# EAGLE design Parking Sensor USB -v17b (EAGLE 5.11)
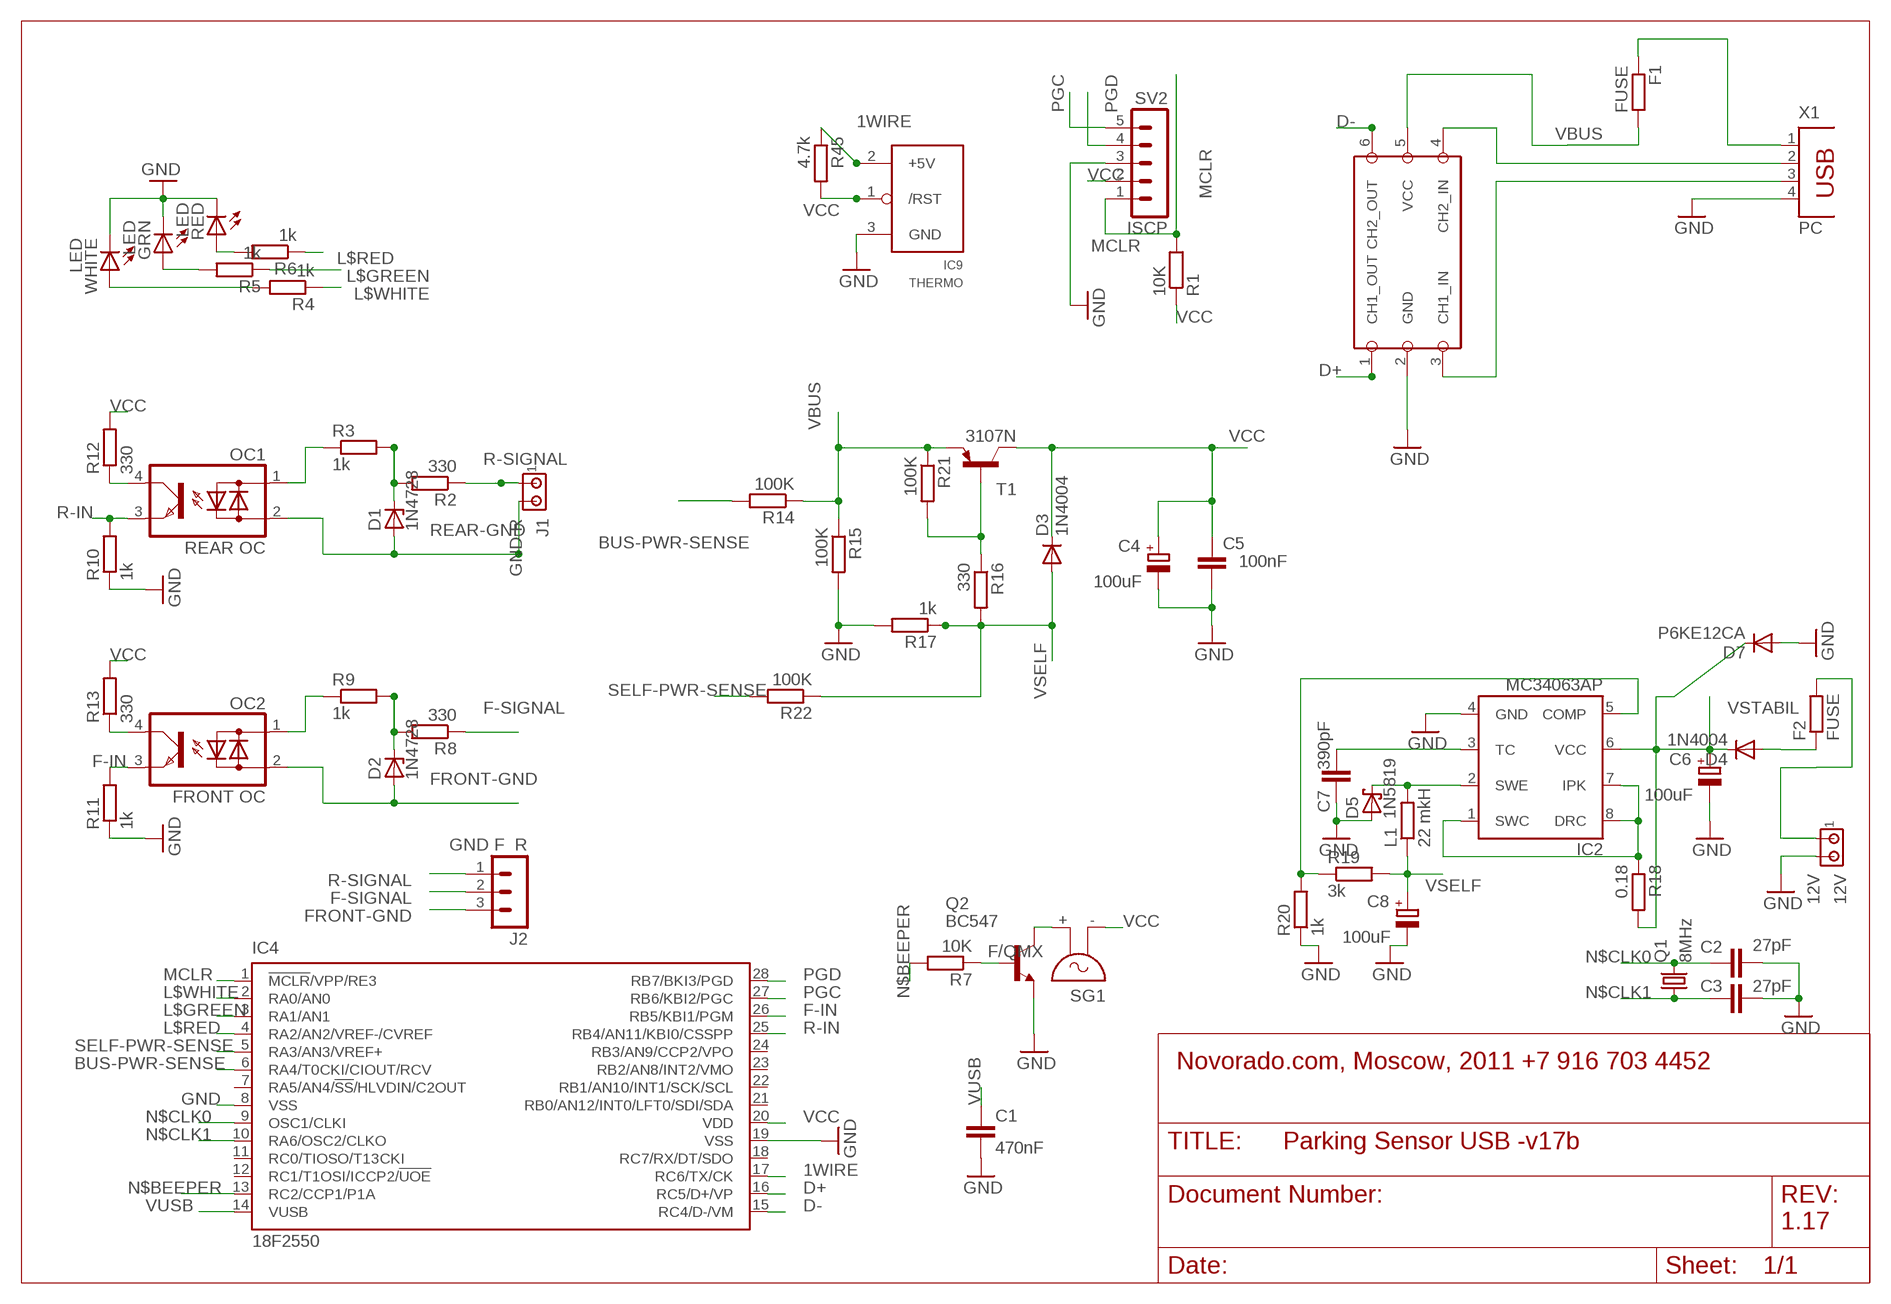
[diagram p0: schematic, sheet 1]

## Parts
12V  12V  MTA02-100  [10X02MTA]
C1  470nF  C-EU025-050X050  [C025-050X050]
C2  27pF  C-EU050-025X075  [C050-025X075]
C3  27pF  C-EU050-025X075  [C050-025X075]
C4  100uF  CPOL-EUE2.5-6  [E2,5-6]
C5  100nF  C-EU025-025X050  [C025-025X050]
C6  100uF  CPOL-EUE2.5-6  [E2,5-6]
C7  390pF  C-EU025-030X050  [C025-030X050]
C8  100uF  CPOL-EUE2.5-6  [E2,5-6]
D1  1N4728  ZENER-DIODEZD-2.5  [ZDIO-2.5]
D2  1N4728  ZENER-DIODEZD-2.5  [ZDIO-2.5]
D3  1N4004  DIODE-D-2.5  [D-2.5]
D4  1N4004  DIODE-D-5  [D-5]
D5  1N5819  1N5819-B  [DO41-7.6]
D7  P6KE12CA  DIODE-D-2.5  [D-2.5]
F1  FUSE  R-EU_0204/2V  [0204V]
F2  FUSE  R-EU_0204/2V  [0204V]
GRN  LED  LED3MM  [LED3MM]
IC2  MC34063AP  [DIL-08]
IC4  18F2550  PIC18F2550_28DIP  [DIL28-3]
IC9  THERMO  DS1813  [TO-92]
J1  GND R  MTA02-100  [10X02MTA]
J2  GND F R  MA03-1  [MA03-1]
L1  22 mkH  R-EU_0411/3V  [0411V]
OC1  REAR OC  PC814  [DIL04]
OC2  FRONT OC  PC814  [DIL04]
Q1  8MHz  CRYSTALHC49S  [HC49/S]
Q2  BC547  BC547-NPN-TO92-CBE  [TO92-CBE]
R1  10K  R-EU_0204/2V  [0204V]
R2  330  R-EU_0204/2V  [0204V]
R3  1k  R-EU_0204/2V  [0204V]
R4  1k  R-EU_0204/2V  [0204V]
R5  1k  R-EU_0204/2V  [0204V]
R6  1k  R-EU_0204/2V  [0204V]
R7  10K  R-EU_0204/2V  [0204V]
R8  330  R-EU_0204/2V  [0204V]
R9  1k  R-EU_0204/2V  [0204V]
R10  1k  R-EU_0204/2V  [0204V]
R11  1k  R-EU_0204/2V  [0204V]
R12  330  R-EU_0204/2V  [0204V]
R13  330  R-EU_0204/2V  [0204V]
R14  100K  R-EU_0204/2V  [0204V]
R15  100K  R-EU_0204/2V  [0204V]
R16  330  R-EU_0204/2V  [0204V]
R17  1k  R-EU_0204/2V  [0204V]
R18  0.18  R-EU_0204/2V  [0204V]
R19  3k  R-EU_0204/2V  [0204V]
R20  1k  R-EU_0204/2V  [0204V]
R21  100K  R-EU_0204/2V  [0204V]
R22  100K  R-EU_0204/2V  [0204V]
R45  4.7k  R-EU_0204/2V  [0204V]
RED  LED  LED3MM  [LED3MM]
SG1  F/QMX  [F/QMX]
SV2  ISCP  MA05-1  [MA05-1]
T1  3107N  2N4126-PNP-TO92-CBE  [TO92-CBE]
U$1  TPD2S017DBVR  [SOT23-DBV]
WHITE  LED  LED3MM  [LED3MM]
X1  PC  PN61729  [PN61729]

## Nets
1WIRE: IC4.17(RC6/TX/CK) IC9.2(+5V) R45.1
BUS-PWR-SENSE: IC4.6(RA4/T0CKI/CIOUT/RCV) R14.2
D+: IC4.16(RC5/D+/VP) U$1.1(CH1_OUT)
D-: IC4.15(RC4/D-/VM) U$1.6(CH2_OUT)
F-IN: IC4.26(RB5/KBI1/PGM) OC2.3(E) R11.2
F-SIGNAL: J2.2 R8.1
FRONT-GND: D2.A J2.3 OC2.2(AC2)
FUSE_USB [ESD]: F1.1 X1.1
GND [ESD]: 12V.2 C1.2 C2.2 C3.2 C4.- C5.2 C6.- C7.1 C8.- D5.A D7.A GRN.K(C) IC2.4(GND) IC4.8(VSS) IC4.19(VSS) IC9.3(GND) Q2.E R10.1 R11.1 R15.2 R17.2 R20.1 RED.K(C) SV2.3 U$1.2(GND) WHITE.K(C) X1.4
L$16: GRN.A R5.2
L$18: R6.2 RED.A
L$20: R4.2 WHITE.A
L$GREEN: IC4.3(RA1/AN1) R5.1
L$RED: IC4.4(RA2/AN2/VREF-/CVREF) R6.1
L$WHITE: IC4.2(RA0/AN0) R4.1
MCLR [ESD]: IC4.1(!MCLR!/VPP/RE3) R1.2 SV2.1
N$1 [ESD]: U$1.4(CH2_IN) X1.2
N$2 [ESD]: U$1.3(CH1_IN) X1.3
N$13: Q2.B R7.1
N$24: Q2.C SG1.+
N$29: R16.1 R21.2 T1.B
N$BEEPER: IC4.13(RC2/CCP1/P1A) R7.2
N$CLK0: C2.1 IC4.9(OSC1/CLKI) Q1.2
N$CLK1: C3.1 IC4.10(RA6/OSC2/CLKO) Q1.1
O1$1: OC1.1(AC1) R3.1
O1$2: OC2.1(AC1) R9.1
O1$3: D2.C R8.2 R9.2
O1$4: OC2.4(C) R13.1
O1$7: D1.C R2.2 R3.2
O1$26: OC1.4(C) R12.1
PGC: IC4.27(RB6/KBI2/PGC) SV2.5
PGD: IC4.28(RB7/BKI3/PGD) SV2.4
R-IN: IC4.25(RB4/AN11/KBI0/CSSPP) OC1.3(E) R10.2
R-SIGNAL: J1.1 J2.1 R2.1
REAR-GND: D1.A J1.2 OC1.2(AC2)
SELF-PWR-SENSE: IC4.5(RA3/AN3/VREF+) R22.2
V5$3 [ESD]: 12V.1 F2.2
V5$4 [ESD]: D4.A F2.1
V5$8: IC2.1(SWC) IC2.7(IPK) IC2.8(DRC) R18.1
V5$15: C7.2 IC2.3(TC)
V5$17: D5.C IC2.2(SWE) L1.2
V5$47: IC2.5(COMP) R19.1 R20.2
VBUS [ESD]: F1.2 R14.1 R15.1 R21.1 T1.E U$1.5(VCC)
VCC [ESD]: C4.+ C5.1 D3.C IC4.20(VDD) IC9.1(/RST) R1.1 R12.2 R13.2 R45.2 SG1.- SV2.2 T1.C
VSELF [ESD]: C8.+ D3.A L1.1 R16.2 R17.1 R19.2 R22.1
VSTABIL [ESD]: C6.+ D4.C D7.C IC2.6(VCC) R18.2
VUSB: C1.1 IC4.14(VUSB)
Unconnected: IC4.7(RA5/AN4/!SS!/HLVDIN/C2OUT) IC4.11(RC0/TIOSO/T13CKI) IC4.12(RC1/T1OSI/ICCP2/!UOE) IC4.18(RC7/RX/DT/SDO) IC4.21(RB0/AN12/INT0/LFT0/SDI/SDA) IC4.22(RB1/AN10/INT1/SCK/SCL) IC4.23(RB2/AN8/INT2/VMO) IC4.24(RB3/AN9/CCP2/VPO)

## Notes on the sheet
- Novorado.com, Moscow, 2011 +7 916 703 4452
- 1.17

## Library data of the parts
12V J1 = con-amp:MTA02-100: AMP connector
C1-C3 C5 C7 = rcl:C-EU: CAPACITOR, European symbol
C4 C6 C8 = rcl:CPOL-EU: POLARIZED CAPACITOR, European symbol
D1 D2 = diode:ZENER-DIODE: Z-Diode
D3 D4 D7 = diode:DIODE-: DIODE
D5 = diode:1N581*: 1.0A SCHOTTKY BARRIER RECTIFIER Source: http://www.diodes.com/datasheets/ds23001.pdf
F1 F2 L1 R2-R6 R8-R13 R19 R20 = resistor:R-EU_: RESISTOR, European symbol
GRN RED WHITE = led:LED: LED OSRAM: - CHIPLED LG R971, LG N971, LY N971, LG Q971, LY Q971, LO R971, LY R971 LH N974, LH R974 LS Q976, LO Q976, LY Q976 LO Q996 - Hyper CHIPLED LW Q18S LB Q993, LB Q99A, LB R99A - SideLED LS A670, LO A670, LY A670, LG A670, LP A670 LB A673, LV A673, LT A673, LW A673 LH A674 LY A675 LS A676, LA A676, LO A676, LY A676, LW A676 LS A679, LY A679, LG A679 - Hyper Micro SIDELED® LS Y876, LA Y876, LO Y876, LY Y876 LT Y87S - SmartLED LW L88C, LW L88S LB L89C, LB L89S, LG L890 LS L89K, LO L89K, LY L89K LS L896, LA L896, LO L896, LY L896 - TOPLED LS T670, LO T670, LY T670, LG T670, LP T670 LSG T670, LSP T670, LSY T670, LOP T670, LYG T670 LG T671, LOG T671, LSG T671 LB T673, LV T673, LT T673, LW T673 LH T674 LS T676, LA T676, LO T676, LY T676, LB T676, LH T676, LSB T676, LW T676 LB T67C, LV T67C, LT T67C, LS T67K, LO T67K, LY T67K, LW E67C LS E67B, LA E67B, LO E67B, LY E67B, LB E67C, LV E67C, LT E67C LW T67C LS T679, LY T679, LG T679 LS T770, LO T770, LY T770, LG T770, LP T770 LB T773, LV T773, LT T773, LW T773 LH T774 LS E675, LA E675, LY E675, LS T675 LS T776, LA T776, LO T776, LY T776, LB T776 LHGB T686 LT T68C, LB T68C - Hyper Mini TOPLED® LB M676 - Mini TOPLED Santana® LG M470 LS M47K, LO M47K, LY M47K Source: http://www.osram.convergy.de LUXEON: - LUMILED® LXK2-PW12-R00, LXK2-PW12-S00, LXK2-PW14-U00, LXK2-PW14-V00 LXK2-PM12-R00, LXK2-PM12-S00, LXK2-PM14-U00 LXK2-PE12-Q00, LXK2-PE12-R00, LXK2-PE12-S00, LXK2-PE14-T00, LXK2-PE14-U00 LXK2-PB12-K00, LXK2-PB12-L00, LXK2-PB12-M00, LXK2-PB14-N00, LXK2-PB14-P00, LXK2-PB14-Q00 LXK2-PR12-L00, LXK2-PR12-M00, LXK2-PR14-Q00, LXK2-PR14-R00 LXK2-PD12-Q00, LXK2-PD12-R00, LXK2-PD12-S00 LXK2-PH12-R00, LXK2-PH12-S00 LXK2-PL12-P00, LXK2-PL12-Q00, LXK2-PL12-R00 Source: www.luxeon.com KINGBRIGHT: KA-3528ASYC Source: www.kingbright.com
IC2 = v-reg-3:MC34063A: 1.5A Step-Up/Down/Inverting Switching Regulator NPN Darlington Switch, Vin 3V to 40V, Current Limiter Input, adjustable Frequency up to 100kHz
IC4 = microchip:PIC18F2*_28: USB Microcontrollers with nanoWatt Technology High-Performance, Enhanced Flash, 28/40/44-Pin, Source: http://ww1.microchip.com/downloads/en/devicedoc/39632c.pdf; MF: MICROCHIP; MPN: PIC18F2550-I/SP; OC_FARNELL: 1523822; OC_NEWARK: 80K6054
IC9 = ds1813:DS1813
J2 = con-lstb:MA03-1: PIN HEADER; OC_FARNELL: unknown; OC_NEWARK: unknown
OC1 OC2 = optocoupler:PC814: SHARP OPTO COUPLER
Q1 = crystal:CRYSTAL: CRYSTAL; OC_FARNELL: 1667008; OC_NEWARK: unknown
Q2 = transistor:*-NPN-: NPN Transistror BF959 corrected 2008.03.06
R1 R7 R14-R18 R21 R22 R45 = rcl:R-EU_: RESISTOR, European symbol
SG1 = buzzer:F/QMX: BUZZER Source: Buerklin; OC_FARNELL: unknown; OC_NEWARK: unknown
SV2 = con-lstb:MA05-1: PIN HEADER
T1 = transistor:*-PNP-: PNP Transistror
U$1 = novorado:TPD2S017DBVR: 2-CHANNEL ULTRA-LOW CLAMP VOLTAGE ESD SOLUTION WITH SERIES-RESISTOR ISOLATION
X1 = con-berg:PN61729: BERG USB connector

## Net classes
1 ESD: width 0.8 mm

## Board
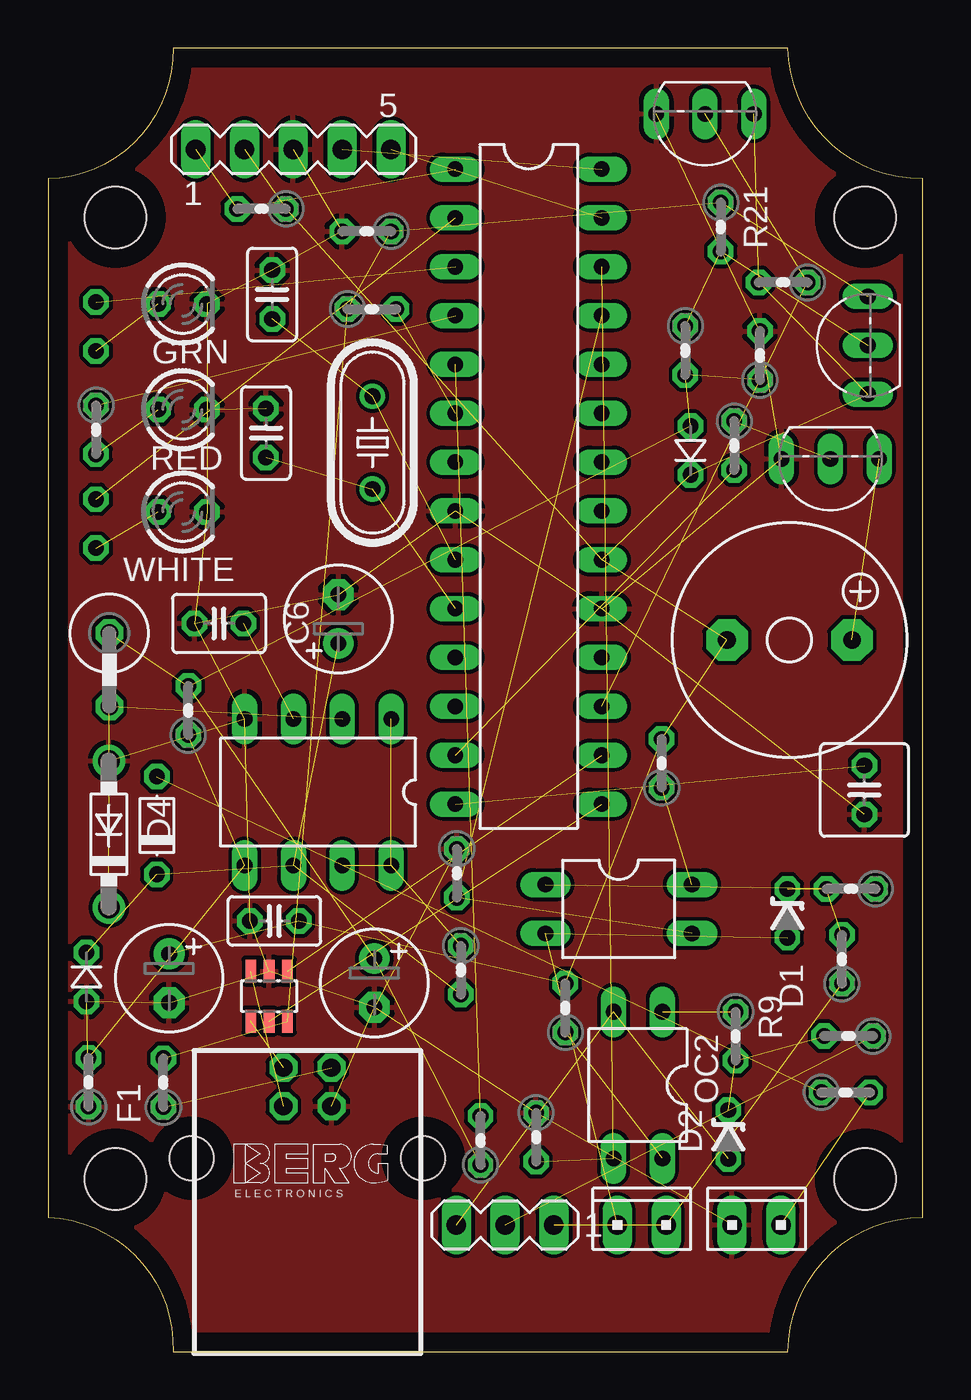
[diagram p1: board, top side]
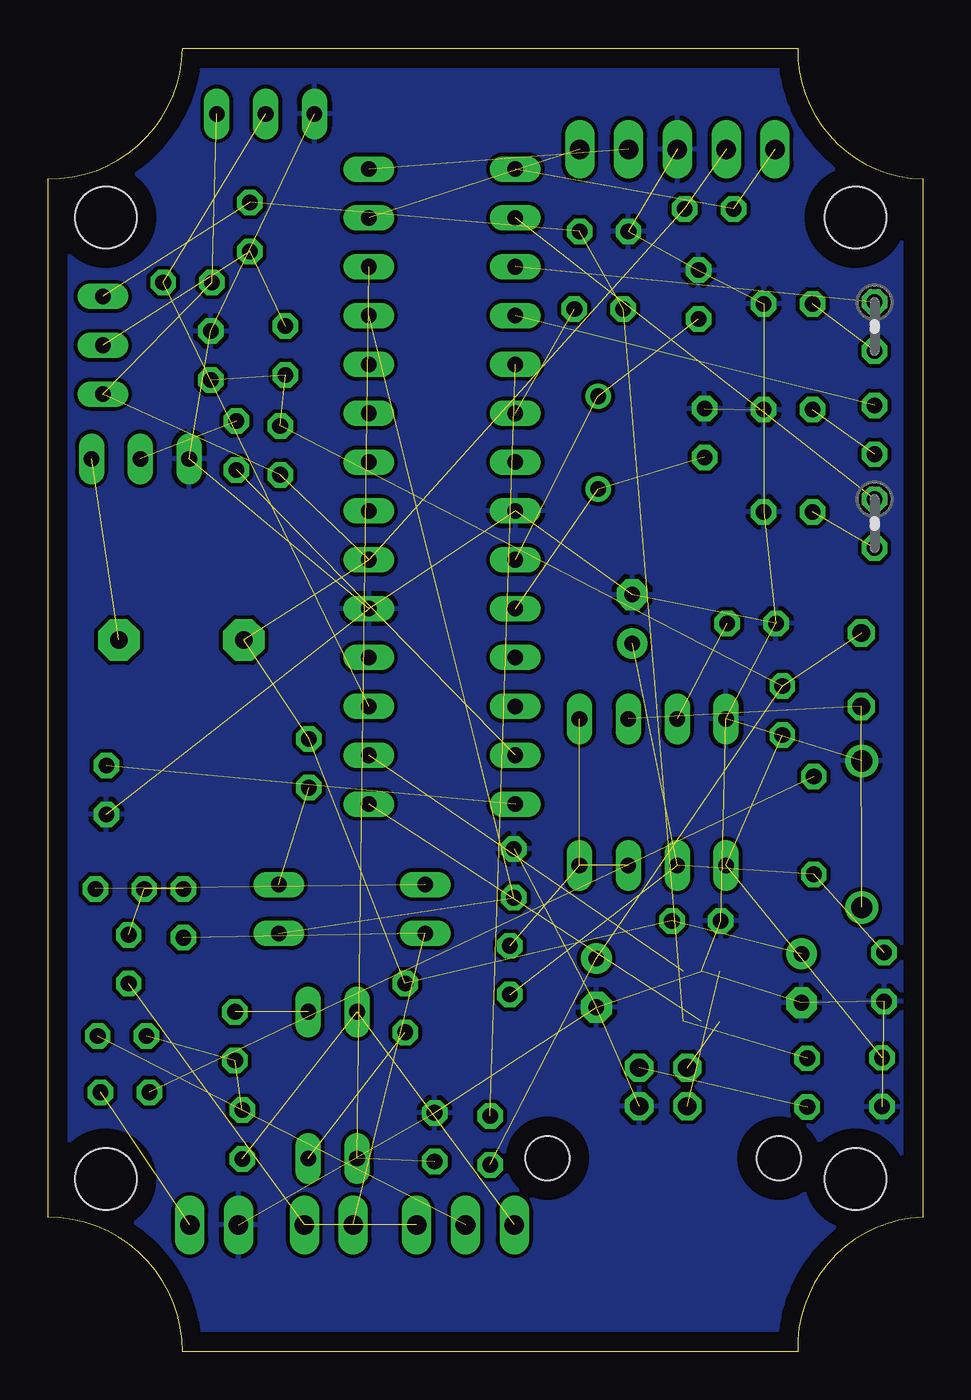
[diagram p2: board, bottom side, seen from below]

Size 45.5 x 67.8 mm. Coordinates in mm from the lower left corner, seen from the top.
Outline: 6.5,0 38.5,0 arc-90 45.5,7 45.5,61 arc-90 38.5,67.8 6.5,67.8 arc-90 0,61 0,7 arc-90 6.5,0
Copper layers (1*16): Top 0.035mm / dielectric 1.5mm / Bottom 0.035mm
Design rules "Parking Sensor USB -v17": minimum track width 10mil, minimum drill 24mil, track to track 8mil, track to pad 8mil, pad to pad 8mil, via to via 8mil, smd to smd 8mil, copper to edge 40mil, drill to drill 8mil, minimum pad ring 10mil, minimum via ring 8mil, stop-mask expansion 4mil, vias tented up to drill 0mil, thermal gap 10mil
Holes 3.2 mm at 3.5,9 3.5,59 42.5,59 42.5,9

### Footprints (pad centres in the part's own frame; a part is rotated, then mirrored left to right if it is on the bottom)
10X02MTA = drill 1.016 long: 1 1.27,0; 2 -1.27,0
C025-050X050 = drill 0.813 octagon: 1 -1.27,0; 2 1.27,0
C025-025X050 = drill 0.813 octagon: 1 -1.27,0; 2 1.27,0
E2,5-6 = drill 0.813 pad 1.6 round: + -1.27,0 | drill 0.813 pad 1.6 octagon: - 1.27,0
C025-030X050 = drill 0.813 octagon: 1 -1.27,0; 2 1.27,0
ZDIO-2.5 = drill 0.813 octagon: A 1.27,0; C -1.27,0
D-2.5 = drill 0.813 octagon: A 1.27,0; C -1.27,0
D-5 = drill 0.813 octagon: A 2.54,0; C -2.54,0
DO41-7.6 = drill 1.1 pad 1.7 round: A 3.81,0; C -3.81,0
0204V = drill 0.813 octagon: 1 -1.27,0; 2 1.27,0
LED3MM = drill 0.813 octagon: A -1.27,0; K 1.27,0
DIL-08 = drill 0.813 long: 1 -3.81,-3.81; 2 -1.27,-3.81; 3 1.27,-3.81; 4 3.81,-3.81; 5 3.81,3.81; 6 1.27,3.81; 7 -1.27,3.81; 8 -3.81,3.81
DIL28-3 = drill 0.813 long: 1 -16.51,-3.81; 2 -13.97,-3.81; 3 -11.43,-3.81; 4 -8.89,-3.81; 5 -6.35,-3.81; 6 -3.81,-3.81; 7 -1.27,-3.81; 8 1.27,-3.81; 9 3.81,-3.81; 10 6.35,-3.81; 11 8.89,-3.81; 12 11.43,-3.81; 13 13.97,-3.81; 14 16.51,-3.81; 15 16.51,3.81; 16 13.97,3.81; 17 11.43,3.81; 18 8.89,3.81; 19 6.35,3.81; 20 3.81,3.81; 21 1.27,3.81; 22 -1.27,3.81; 23 -3.81,3.81; 24 -6.35,3.81; 25 -8.89,3.81; 26 -11.43,3.81; 27 -13.97,3.81; 28 -16.51,3.81
TO-92 = drill 0.813 long: 1 -2.54,0; 2 0,0; 3 2.54,0
MA03-1 = drill 1.016 long: 1 -2.54,0; 2 0,0; 3 2.54,0
0411V = drill 0.914 octagon: 1 -2.54,0; 2 1.27,0
DIL04 = drill 0.813 long: 1 -1.27,-3.81; 2 1.27,-3.81; 3 1.27,3.81; 4 -1.27,3.81
HC49/S = drill 0.813 round: 1 -2.413,0; 2 2.413,0
TO92-CBE = drill 0.813 long: B 0,0; C -2.54,0; E 2.54,0
F/QMX = drill 0.914 pad 2.159 octagon: + 3.251,0; - -3.251,0
MA05-1 = drill 1.016 long: 1 -5.08,0; 2 -2.54,0; 3 0,0; 4 2.54,0; 5 5.08,0
SOT23-DBV = smd 0.55 x 1.2: 1 -0.95,-1.3; 2 0,-1.3; 3 0.95,-1.3; 4 0.95,1.3; 5 -0.95,1.3; 6 -0.003,1.3
PN61729 = drill 0.95 octagon: 1 1.25,4.71; 2 -1.25,4.71; 3 -1.25,2.71; 4 1.25,2.71 | hole 2.3: -6.02,0; 6.02,0

### Placement (x,y rotation side)
12V  36.86,6.6 0 top
C1  42.47,29.22 270 top
C2  27pF  [C025-025X050]  11.66,54.99 90 top
C3  27pF  [C025-025X050]  11.34,47.78 90 top
C4  6.3,19.43 270 top
C5  11.77,22.41 180 top
C6  15.11,38.11 90 top
C7  8.89,37.88 0 top
C8  16.97,19.19 270 top
D1  38.46,22.81 270 top
D2  35.39,11.31 270 top
D3  33.42,46.88 90 top
D4  5.66,27.38 90 top
D5  3.16,26.92 90 top
D7  2,19.5 270 top
F1  6,14 90 top
F2  41.5,13.5 0 top
GRN  7,54.5 0 top
IC2  14.04,29.11 180 top
IC4  25,45 270 top
IC9  34.18,64.38 180 top
J1  30.89,6.6 0 top
J2  23.78,6.6 180 top
L1  3.19,34.84 270 top
OC1  29.69,23.04 270 top
OC2  30.69,13.88 180 top
Q1  16.88,47.28 90 top
Q2  40.7,46.44 180 top
R1  11.11,59.44 180 top
R2  41.31,20.42 90 top
R3  41.77,24.08 180 top
R4  2.5,43.07 270 bottom
R5  2.5,53.32 270 bottom
R6  2.5,47.95 270 top
R7  35.7,47.13 270 top
R8  41.65,16.42 180 top
R9  35.77,16.42 270 top
R10  21.27,24.89 270 top
R11  25.39,11.16 270 top
R12  31.92,30.61 90 top
R13  26.92,17.89 90 top
R14  16.85,54.23 0 top
R15  16.58,58.27 180 top
R16  33.15,52.08 270 top
R17  37.04,51.81 90 top
R18  21.47,19.85 270 top
R19  7.3,33.35 90 top
R20  2.11,14.03 90 top
R21  35,58.5 270 top
R22  22.5,11 90 top
R45  38.24,55.61 180 top
RED  7,49 0 top
SG1  38.57,37.02 0 top
SV2  12.76,62.53 0 top
T1  42.65,52.35 90 top
U$1  11.5,18.5 180 top
WHITE  7,43.68 0 top
X1  13.49,10.07 0 top

### Tracks (layer width: path | path; a pad name or v marks a point on that pad's centre or on a via)
1WIRE  (2 unrouted)
BUS-PWR-SENSE  (1 unrouted)
D+  (1 unrouted)
D-  (1 unrouted)
F-IN  (2 unrouted)
F-SIGNAL  (1 unrouted)
FRONT-GND  (2 unrouted)
FUSE_USB  (1 unrouted)
GND  (26 unrouted)
  pour Bottom: 0,60.5 0,7.5 arc-90 7,0 38,0 arc-90 45.5,7.5 45.5,61 44.5,61 arc-90 38.5,67.5 7,67.5 arc-90
  pour Top: 0,60.5 0,7.5 arc-90 7,0 38,0 arc-90 45.5,7.5 45.5,61 44,61 arc-90 38.5,67.5 7,67.5 arc-90
L$16  (1 unrouted)
L$18  (1 unrouted)
L$20  (1 unrouted)
L$GREEN  (1 unrouted)
L$RED  (1 unrouted)
L$WHITE  (1 unrouted)
MCLR  (2 unrouted)
N$1  (1 unrouted)
N$2  (1 unrouted)
N$13  (1 unrouted)
N$24  (1 unrouted)
N$29  (2 unrouted)
N$BEEPER  (1 unrouted)
N$CLK0  (2 unrouted)
N$CLK1  (2 unrouted)
O1$1  (1 unrouted)
O1$2  (1 unrouted)
O1$3  (2 unrouted)
O1$4  (1 unrouted)
O1$7  (2 unrouted)
O1$26  (1 unrouted)
PGC  (1 unrouted)
PGD  (1 unrouted)
R-IN  (2 unrouted)
R-SIGNAL  (2 unrouted)
REAR-GND  (2 unrouted)
SELF-PWR-SENSE  (1 unrouted)
V5$3  (1 unrouted)
V5$4  (1 unrouted)
V5$8  (3 unrouted)
V5$15  (1 unrouted)
V5$17  (2 unrouted)
V5$47  (2 unrouted)
VBUS  (5 unrouted)
VCC  (11 unrouted)
VSELF  (6 unrouted)
VSTABIL  (4 unrouted)
VUSB  (1 unrouted)